# EAGLE design tdlf_16_02_2020_LED (EAGLE 9.4.0)
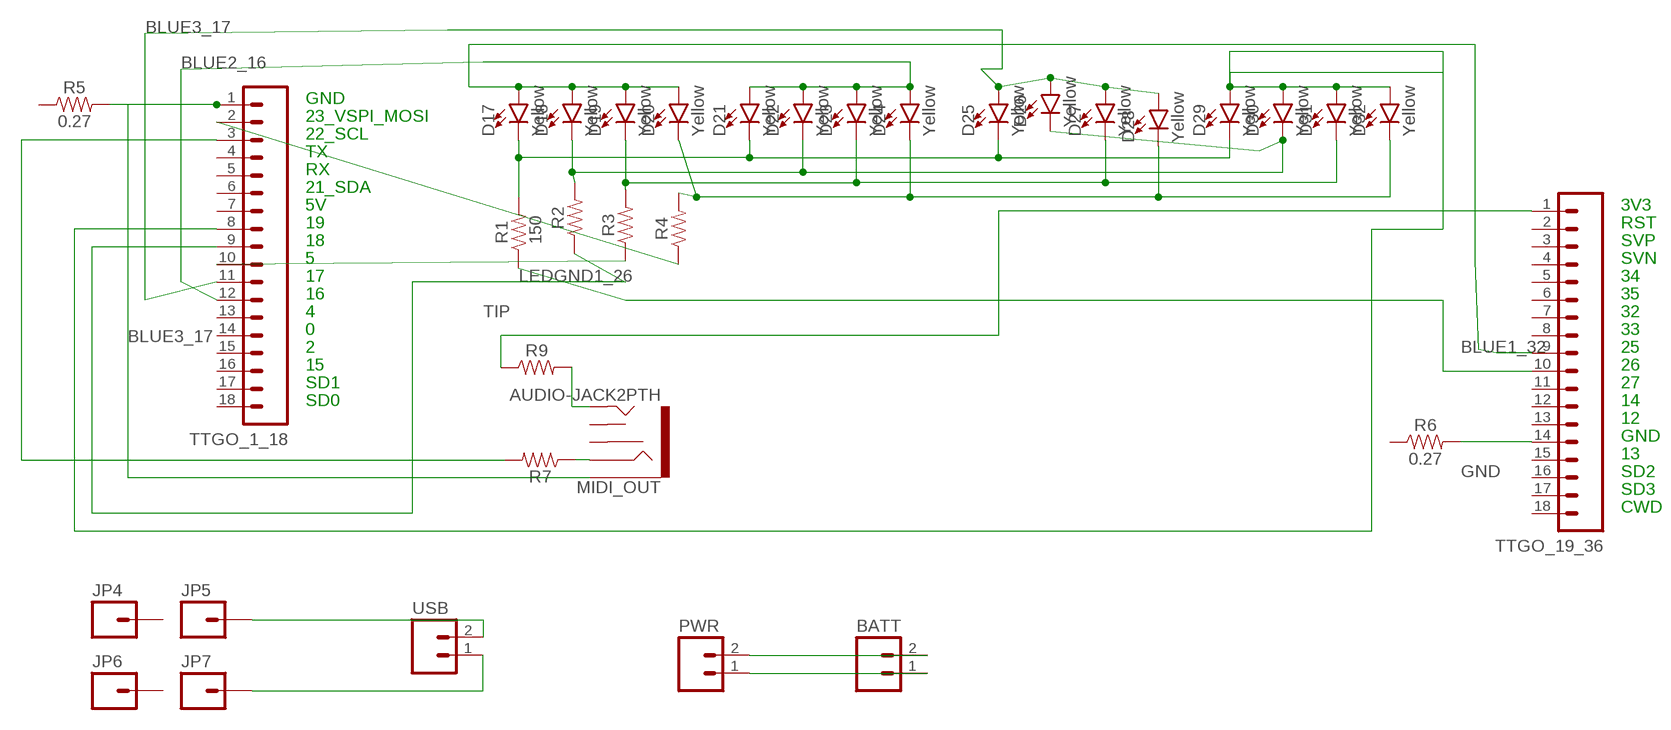
[diagram p0: schematic, sheet 1]

## Parts
BATT  M02PTH  [1X02]
D17  Yellow  LED-YELLOWLILYPAD  [LED-1206]
D18  Yellow  LED-YELLOWLILYPAD  [LED-1206]
D19  Yellow  LED-YELLOWLILYPAD  [LED-1206]
D20  Yellow  LED-YELLOWLILYPAD  [LED-1206]
D21  Yellow  LED-YELLOWLILYPAD  [LED-1206]
D22  Yellow  LED-YELLOWLILYPAD  [LED-1206]
D23  Yellow  LED-YELLOWLILYPAD  [LED-1206]
D24  Yellow  LED-YELLOWLILYPAD  [LED-1206]
D25  Yellow  LED-YELLOWLILYPAD  [LED-1206]
D26  Yellow  LED-YELLOWLILYPAD  [LED-1206]
D27  Yellow  LED-YELLOWLILYPAD  [LED-1206]
D28  Yellow  LED-YELLOWLILYPAD  [LED-1206]
D29  Yellow  LED-YELLOWLILYPAD  [LED-1206]
D30  Yellow  LED-YELLOWLILYPAD  [LED-1206]
D31  Yellow  LED-YELLOWLILYPAD  [LED-1206]
D32  Yellow  LED-YELLOWLILYPAD  [LED-1206]
JP4  M01PTH  [1X01]
JP5  M01PTH  [1X01]
JP6  M01PTH  [1X01]
JP7  M01PTH  [1X01]
MIDI_OUT  AUDIO-JACK2PTH  [AUDIO-JACK]
PWR  M02PTH  [1X02]
R1  150  RESISTOR1206  [1206]
R2  RESISTOR1206  [1206]
R3  RESISTOR1206  [1206]
R4  RESISTOR1206  [1206]
R5  0.27  0.27OHM-0603-1/10W-1%  [0603]
R6  0.27  0.27OHM-0603-1/10W-1%  [0603]
R7  RESISTOR1206  [1206]
R9  RESISTOR1206  [1206]
TTGO_1_18  M18_  [1X18]
TTGO_19_36  M18_  [1X18]
USB  M02PTH  [1X02]

## Nets
3.3V: R9.1 TTGO_19_36.1
BLUE1_32: D17.A D18.A D19.A D20.A TTGO_19_36.9
BLUE2_16: D21.A D22.A D23.A D24.A TTGO_1_18.12
BLUE3_17: D25.A D26.A D27.A D28.A TTGO_1_18.11
BLUE4_34: D29.A D30.A D31.A D32.A TTGO_1_18.8
GND: MIDI_OUT.SLEEVE R5.2 R6.2 TTGO_1_18.1 TTGO_19_36.14
LEDGND1_26: R1.1 TTGO_19_36.10
LEDGND2_SVP: R2.1 TTGO_1_18.9
LEDGND3_5_VSPI_SS: R3.1 TTGO_1_18.10
LEDGND4_23: R4.1 TTGO_1_18.2
MIDI_DATA: R7.2 TTGO_1_18.3
N$1: D17.C D21.C D25.C D29.C R1.2
N$2: D18.C D22.C D26.C D30.C R2.2
N$3: D19.C D23.C D27.C D31.C R3.2
N$4: D20.C D24.C D28.C D32.C R4.2
N$5: JP5.1 USB.2
N$6: JP7.1 USB.1
N$7: BATT.2 PWR.2
N$8: BATT.1 PWR.1
RING: MIDI_OUT.RING R7.1
TIP: MIDI_OUT.TIP R9.2
Unconnected: JP4.1 JP6.1 MIDI_OUT.RSH MIDI_OUT.TSH R5.1 R6.1 TTGO_1_18.4 TTGO_1_18.5 TTGO_1_18.6 TTGO_1_18.7 TTGO_1_18.13 TTGO_1_18.14 TTGO_1_18.15 TTGO_1_18.16 TTGO_1_18.17 TTGO_1_18.18 TTGO_19_36.2 TTGO_19_36.3 TTGO_19_36.4 TTGO_19_36.5 TTGO_19_36.6 TTGO_19_36.7 TTGO_19_36.8 TTGO_19_36.11 TTGO_19_36.12 TTGO_19_36.13 TTGO_19_36.15 TTGO_19_36.16 TTGO_19_36.17 TTGO_19_36.18

## Notes on the sheet
- GND
- 23_VSPI_MOSI
- 22_SCL
- TX
- RX
- 21_SDA
- 5V | 3V3
- 19 | RST
- 18 | SVP
- 5 | SVN
- 17 | 34
- 16 | 35
- 4 | 32
- 0 | 33
- 2 | 25
- 15 | 26
- SD1 | 27
- SD0 | 14
- 12
- GND
- 13
- SD2
- SD3
- CWD

## Library data of the parts
BATT PWR USB = SparkFun-Connectors:M02: Standard 2-pin 0.1" header. Use with - straight break away headers ( PRT-00116) - right angle break away headers (PRT-00553) - swiss pins (PRT-00743) - machine pins (PRT-00117) - female headers (PRT-00115) Molex polarized connector foot print use with: PRT-08233 with associated crimp pins and housings. 2.54_SCREWTERM for use with PRT-10571. 3.5mm Screw Terminal footprints for PRT-08084 5mm Screw Terminal footprints for use with PRT-08432
D17-D32 = SparkFun-LED:LED-YELLOW: Yellow SMD LED Used in manufacturing several products at SparkFun. Packages: 0603 - SMD 0603 package[Product Link] <http://www.kingbrightusa.com/product.asp?catalog_name=LED&product_id=APT1608SYCK> 0603 -SMART - SMART SMD 0603 package (more efficient/more expensive) [Product Link] <http://www.osram-os.com/osram_os/en/products/product-catalog/led-light-emitting-diodes/smartled-0603/ly-l29k/index.jsp> LilyPad - SMD1206 package[Product Datasheet] <https://www.sparkfun.com/datasheets/DevTools/LilyPad/Q150YUS4.pdf> SparkFun Products: Blynk Board <https://www.sparkfun.com/products/13794> IOIO-OTG <https://www.sparkfun.com/products/13613> XBee Explorer Serial <https://www.sparkfun.com/products/13225>; PROD_ID: DIO-09909
JP4-JP7 = SparkFun-Connectors:M01: Header 1 Standard 1-pin 0.1" header. Use with straight break away headers (SKU : PRT-00116), right angle break away headers (PRT-00553), swiss pins (PRT-00743), machine pins (PRT-00117), and female headers (PRT-00115).
MIDI_OUT = SparkFun-Connectors:AUDIO-JACK2: Stereo audio jack with bypass switches. SMT version used on LilyPad MP3 board.; PROD_ID: CONN-08774
R1-R4 R7 R9 = SparkFun-Resistors:RESISTOR: Generic Resistor Package
R5 R6 = SparkFun-Resistors:0.27OHM: 0.27Ω resistor A resistor is a passive two-terminal electrical component that implements electrical resistance as a circuit element. Resistors act to reduce current flow, and, at the same time, act to lower voltage levels within circuits. - Wikipedia; PROD_ID: RES-08787
TTGO_1_18 TTGO_19_36 = SparkFun-Connectors:M18: 1x18 .1" header

## Board
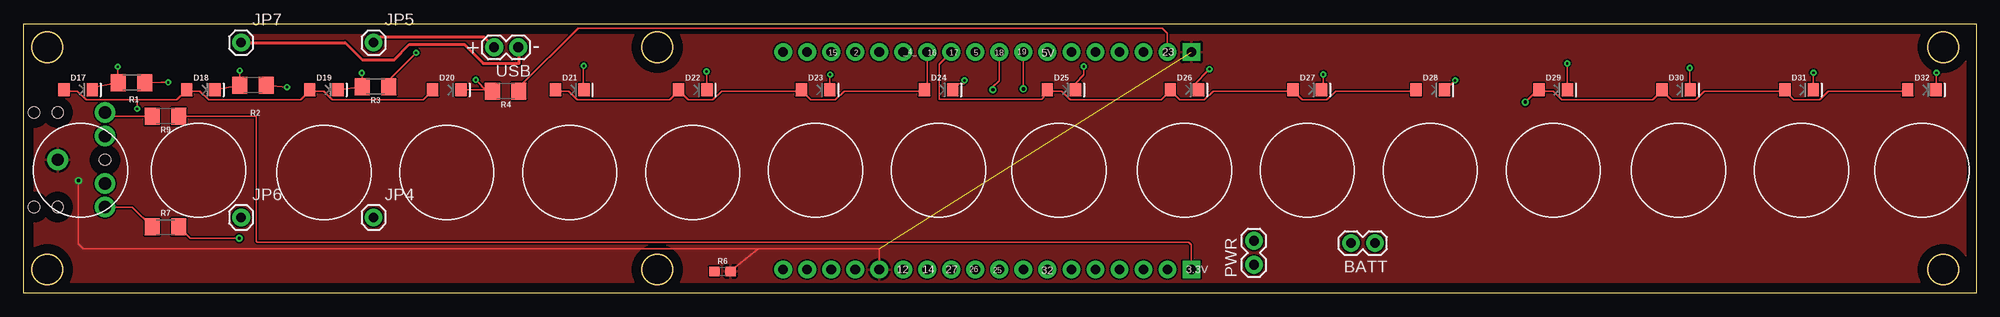
[diagram p1: board, top side]
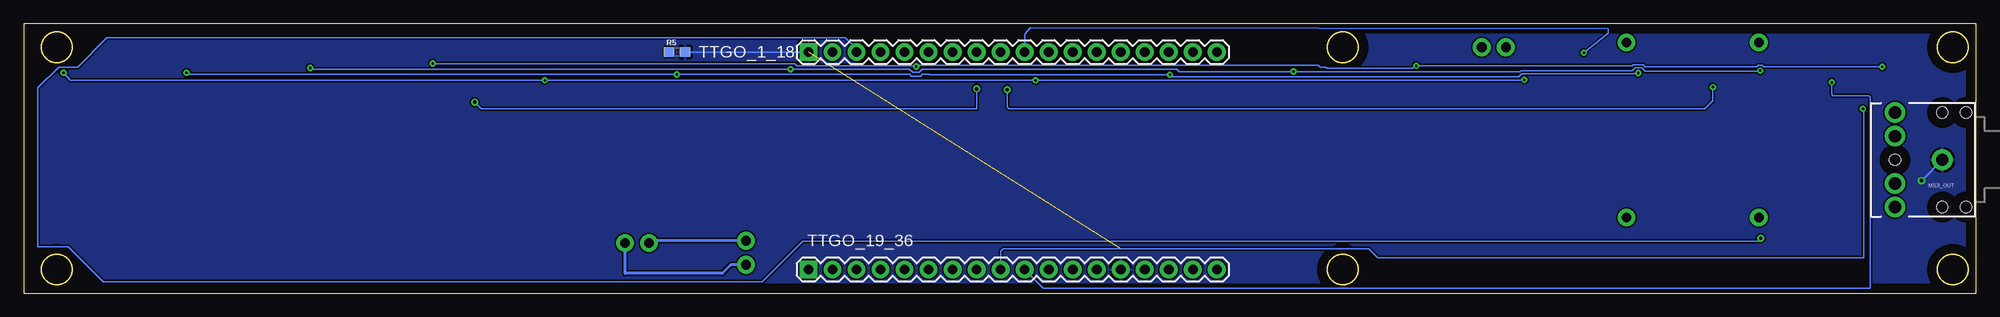
[diagram p2: board, bottom side, seen from below]

Size 206.5 x 28.5 mm. Coordinates in mm from the lower left corner, seen from the top.
Outline: 206.5,0 0,0 0,28.5 206.5,28.5 206.5,0
Outline: circle at 2.5,26 radius 1.6
Outline: circle at 2.5,2.5 radius 1.6
Outline: circle at 67,2.5 radius 1.6
Outline: circle at 67,26 radius 1.6
Outline: circle at 203,26 radius 1.6
Outline: circle at 203,2.5 radius 1.6
Copper layers (1*16): Top 0.035mm / dielectric 1.5mm / Bottom 0.035mm
Design rules "default": minimum track width 6mil, minimum drill 0.35mm, track to track 6mil, track to pad 6mil, pad to pad 6mil, via to via 6mil, smd to smd 6mil, copper to edge 40mil, drill to drill 6mil, minimum pad ring 10mil, minimum via ring 8mil, stop-mask expansion 4mil, vias tented up to drill 0mil, thermal gap 10mil

### Footprints (pad centres in the part's own frame; a part is rotated, then mirrored left to right if it is on the bottom)
1X02 = drill 1.016 pad 1.88: 1 0,0; 2 2.54,0
LED-1206 = smd 1.2 x 1.4: A -1.5,0; C 1.5,0
1X01 = drill 1.016 pad 1.88: 1 0,0
AUDIO-JACK = drill 1.3 pad 2.184: RING 5,5; RSH 5,2.5; SLEEVE 0,0; TIP 5,-5; TSH 5,-2.5 | hole 1.2: 0,5; -2.5,5; -2.5,-5; 0,-5; 5,0
1206 = smd 1.6 x 1.8: 1 -1.4,0; 2 1.4,0
0603 = smd 1.1 x 1: 1 -0.85,0; 2 0.85,0
1X18 = drill 1.016 pad 1.88 square: 1 0,0 | drill 1.016 pad 1.88: 2 2.54,0; 3 5.08,0; 4 7.62,0; 5 10.16,0; 6 12.7,0; 7 15.24,0; 8 17.78,0; 9 20.32,0; 10 22.86,0; 11 25.4,0; 12 27.94,0; 13 30.48,0; 14 33.02,0; 15 35.56,0; 16 38.1,0; 17 40.64,0; 18 43.18,0

### Placement (x,y rotation side)
BATT  142.9,5.3 180 top
D17  5.75,21.5 0 top
D18  18.75,21.5 0 top
D19  31.75,21.5 0 top
D20  44.75,21.5 0 top
D21  57.75,21.5 0 top
D22  70.75,21.5 0 top
D23  83.75,21.5 0 top
D24  96.75,21.5 0 top
D25  109.75,21.5 0 top
D26  122.75,21.5 0 top
D27  135.75,21.5 0 top
D28  148.75,21.5 0 top
D29  161.75,21.5 0 top
D30  174.75,21.5 0 top
D31  187.75,21.5 0 top
D32  200.75,21.5 0 top
JP4  37,8 0 top
JP5  37,26.5 0 top
JP6  23,8 0 top
JP7  23,26.5 0 top
MIDI_OUT  3.6,14.1 180 bottom
PWR  130.1,3 90 top
R1  11.42,22.26 180 top
R2  24.25,21.98 180 top
R3  37.21,21.82 180 top
R4  50.98,21.37 180 top
R5  137.4,25.5 0 bottom
R6  73.9,2.3 0 top
R7  15,7 0 top
R9  15,18.7 180 top
TTGO_1_18  123.5,25.5 0 bottom
TTGO_19_36  123.5,2.5 0 bottom
USB  52.3,26 180 top

### Tracks (layer width: path | path; a pad name or v marks a point on that pad's centre or on a via)
3.3V
  Top 0.152: TTGO_19_36.1 123.5,5.1 123.2,5.4 38.2,5.4 37.9,5.4 24.7,5.4 24.6,5.5 24.6,18.7 R9.1
BLUE1_32  (via drill 0.25)
  Top 0.152: 12,20.44 16.2,20.44 17.12,21.35 D18.A 17.27,21.35 18.64,21.35 19.55,20.44 29.31,20.44 30.22,21.35 D19.A 30.38,21.35 31.75,21.35 32.66,20.44 42.26,20.44 43.18,21.35 D20.A 43.33,21.35 | 12,20.44 6.6,20.44 5.69,21.35 4.32,21.35 D17.A | 12,20.44 v12,19.5
  Bottom 0.152: v12,19.5 11.9,19.4 11.9,3.76 63.32,3.76 64.23,4.67 102.91,4.67 103.18,4.41 TTGO_19_36.9
BLUE2_16
  Top 0.152: D21.A 56.28,21.35 57.66,21.35 58.57,20.44 68.32,20.44 69.24,21.35 D22.A 69.39,21.35 70.3,20.44 72.89,20.44 73.81,21.35 82.19,21.35 D23.A 82.34,21.35 83.26,20.44 85.85,20.44 86.76,21.35 95.15,21.35 D24.A 95.56,21.81 TTGO_1_18.12
BLUE3_17
  Top 0.152: D25.A 108.25,21.35 109.78,21.35 110.69,20.44 120.29,20.44 121.21,21.35 D26.A 121.36,21.35 122.27,20.44 124.86,20.44 125.78,21.35 134.16,21.35 D27.A 134.31,21.35 135.23,20.44 137.82,20.44 138.73,21.35 147.11,21.35 D28.A | 108.1,21.5 D25.A | TTGO_1_18.11 96.82,24.22 96.82,20.51 107.69,20.51 107.88,20.7 107.88,21.13 D25.A
BLUE4_34  (via drill 0.35)
  Top 0.152: 160.37,21.35 161.74,21.35 162.66,20.44 172.26,20.44 173.17,21.35 D30.A 173.33,21.35 174.24,20.44 176.83,20.44 177.75,21.35 186.13,21.35 D31.A 186.28,21.35 187.19,20.44 189.94,20.44 190.85,21.35 199.24,21.35 D32.A | 160.37,21.35 D29.A 160.22,21.35 | 160.37,21.35 160.37,21.4 160,21.4 v158.8,20.2 | TTGO_1_18.8 v105.72,21.6
  Bottom 0.152: v105.72,21.6 105.72,19.5 158.1,19.5 v158.8,20.2
GND  (via drill 0.35)  (1 unrouted)
  Top 0.152: TTGO_19_36.14 90.48,4.68 90.5,4.7 77.7,4.7 | 77.7,4.7 R6.2 | v5.8,11.9 5.8,5.2 6.3,4.7 77.7,4.7
  Bottom 0.152: TTGO_1_18.1 R5.2 | MIDI_OUT.SLEEVE v5.8,11.9
  pour Top: 0.1,28.4 0.1,0.1 206.4,0.1 206.4,28.4
  pour Bottom: 0.12,28.36 0.12,0.09 206.4,0.09 206.4,28.36
LEDGND1_26  (via drill 0.25)
  Top 0.152: R1.1 14.53,22.29 v15.29,22.29
  Bottom 0.152: v15.29,22.29 15.29,21.02 15.17,20.9 11.4,20.9 11.2,20.7 11.2,0.53 98.67,0.53 TTGO_19_36.10
LEDGND2_SVP  (via drill 0.25, 0.35)
  Top 0.152: v27.86,21.78 R2.1 | TTGO_1_18.9 103.18,22.48 102.5,21.8 v102.5,21.5
  Bottom 0.152: 27.86,21.4 v27.86,21.78 27.86,20.34 28.7,19.5 102.3,19.5 102.5,19.7 v102.5,21.5
LEDGND3_5_VSPI_SS  (via drill 0.25)
  Top 0.152: R3.1 38.87,22.07 38.87,22.78 v41.51,25.43
  Bottom 0.152: v41.51,25.43 38.91,27.51 38.91,27.93 100.06,28.07 100.64,27.36 TTGO_1_18.10
LEDGND4_23
  Top 0.152: R4.1 52.38,21.77 58.63,28.02 120.4,28.02 120.96,27.46 TTGO_1_18.2
MIDI_DATA  (via drill 0.35)
  Top 0.152: v22.8,5.8 17.6,5.8 R7.2
  Bottom 0.152: TTGO_1_18.3 118.42,25.82 119.6,27 197.7,27 200.8,23.9 202.8,23.9 205,21.7 205,4.9 201.8,4.9 198.1,1.2 128.4,1.2 124.1,5.5 22.8,5.5 v22.8,5.8
N$1  (via drill 0.25)
  Top 0.152: D21.C 59.21,21.54 59.2,21.76 59.2,24.01 v59.23,24.04 | D25.C 111.25,22.21 112.11,23.08 v112.11,23.97 | D29.C v163.25,24.29 v163.24,24.3 | D17.C 7.6,21.85 R1.2 9.95,22.33 v9.95,23.94
  Bottom 0.152: v112.11,23.97 112.11,24.02 112.04,24.09 | v112.11,23.97 112.14,23.99 112.14,24.04 112.16,24.07 124.76,24.07 124.94,24.25 163.19,24.25 v163.24,24.3 | v9.95,23.94 22.48,23.94 22.63,24.09 23.09,24.09 23.24,23.94 35.05,23.94 35.25,24.14 36.27,24.14 36.37,24.04 v59.23,24.04 59.29,24.09 59.58,23.8 68.7,23.8 68.8,23.9 69.4,23.9 69.6,24.1 111.98,24.1 v112.11,23.97
N$2  (via drill 0.25)
  Top 0.152: 23.04,22.21 R2.2 | 20.32,21.5 D18.C R2.2 | D22.C 72.25,23.43 v72.21,23.43 | 176.22,21.5 D30.C 176.2,21.55 v176.2,23.81 | R2.2 22.86,21.99 v22.86,23.53 | v125.4,23.69 123.72,22.01 123.72,21.96 124.18,21.5 D26.C
  Bottom 0.152: v22.86,23.53 22.91,23.48 35.02,23.48 35.38,23.84 36.07,23.84 36.4,23.51 48.18,23.51 48.26,23.43 v72.21,23.43 84.3,23.43 84.55,23.69 111.45,23.69 111.78,23.36 112.49,23.36 112.82,23.69 v125.4,23.69 176.07,23.69 v176.2,23.81
N$3  (via drill 0.25)
  Top 0.152: 33.27,21.5 D19.C R3.2 | v85.29,23.1 85.25,23.06 D23.C | v137.44,23.13 137.44,21.5 D27.C | 189.33,21.5 D31.C 189.26,23.25 v189.28,23.31 | 35.3,21.82 R3.2 | R3.2 35.43,21.82 | R3.2 35.81,21.57 | R3.2 35.81,23.23 v35.76,23.28
  Bottom 0.152: v35.76,23.28 35.84,23.2 48.05,23.2 48.38,22.87 85.21,22.87 85.29,22.95 v85.29,23.1 85.31,23.13 85.34,23.1 110.69,23.1 110.72,23.13 111.48,23.13 111.66,22.95 112.62,22.95 112.8,23.13 v137.44,23.13 189.1,23.13 v189.28,23.31
N$4  (via drill 0.25)
  Top 0.152: 46.23,21.5 D20.C 49.44,21.5 R4.2 48.99,21.37 v47.8,22.55 | v151.38,22.5 150.31,21.5 D28.C | v202.28,23.31 202.28,21.5 D32.C | D24.C 98.91,22.16 99.49,22.16 v99.49,22.5
  Bottom 0.152: v47.8,22.55 47.85,22.5 v99.49,22.5 v151.38,22.5 201.55,22.5 v202.28,23.31
N$5
  Top 0.305: JP5.1 37.6,27.1 48.66,27.1 USB.2
N$6
  Top 0.305: JP7.1 34,26.5 35.8,24.7 39.2,24.7 40.8,26.3 46.6,26.3 48.6,24.3 52.4,24.3 52.4,25.9 USB.1
N$7
  Bottom 0.305: PWR.2 140.12,5.54 BATT.2
N$8
  Bottom 0.305: PWR.1 131.7,3 132.6,2.1 142.9,2.1 BATT.1
RING
  Top 0.152: R7.1 11.5,9.1 MIDI_OUT.RING
TIP
  Top 0.152: MIDI_OUT.TIP 9,18.7 R9.2

### Text on the board
tNames: + | - | 15 | 2 | _4_ | 16 | 17 | 5 | 18 | 19 | 23 | 5V | 12 | 14 | 27 | 26 | 25 | 32 | 3.3V
tValues: 13